# Altium schematic sheet Ref.03_DDR_Memory_2.SchDoc
size A2; SheetNumber: 11; SheetTotal: 11
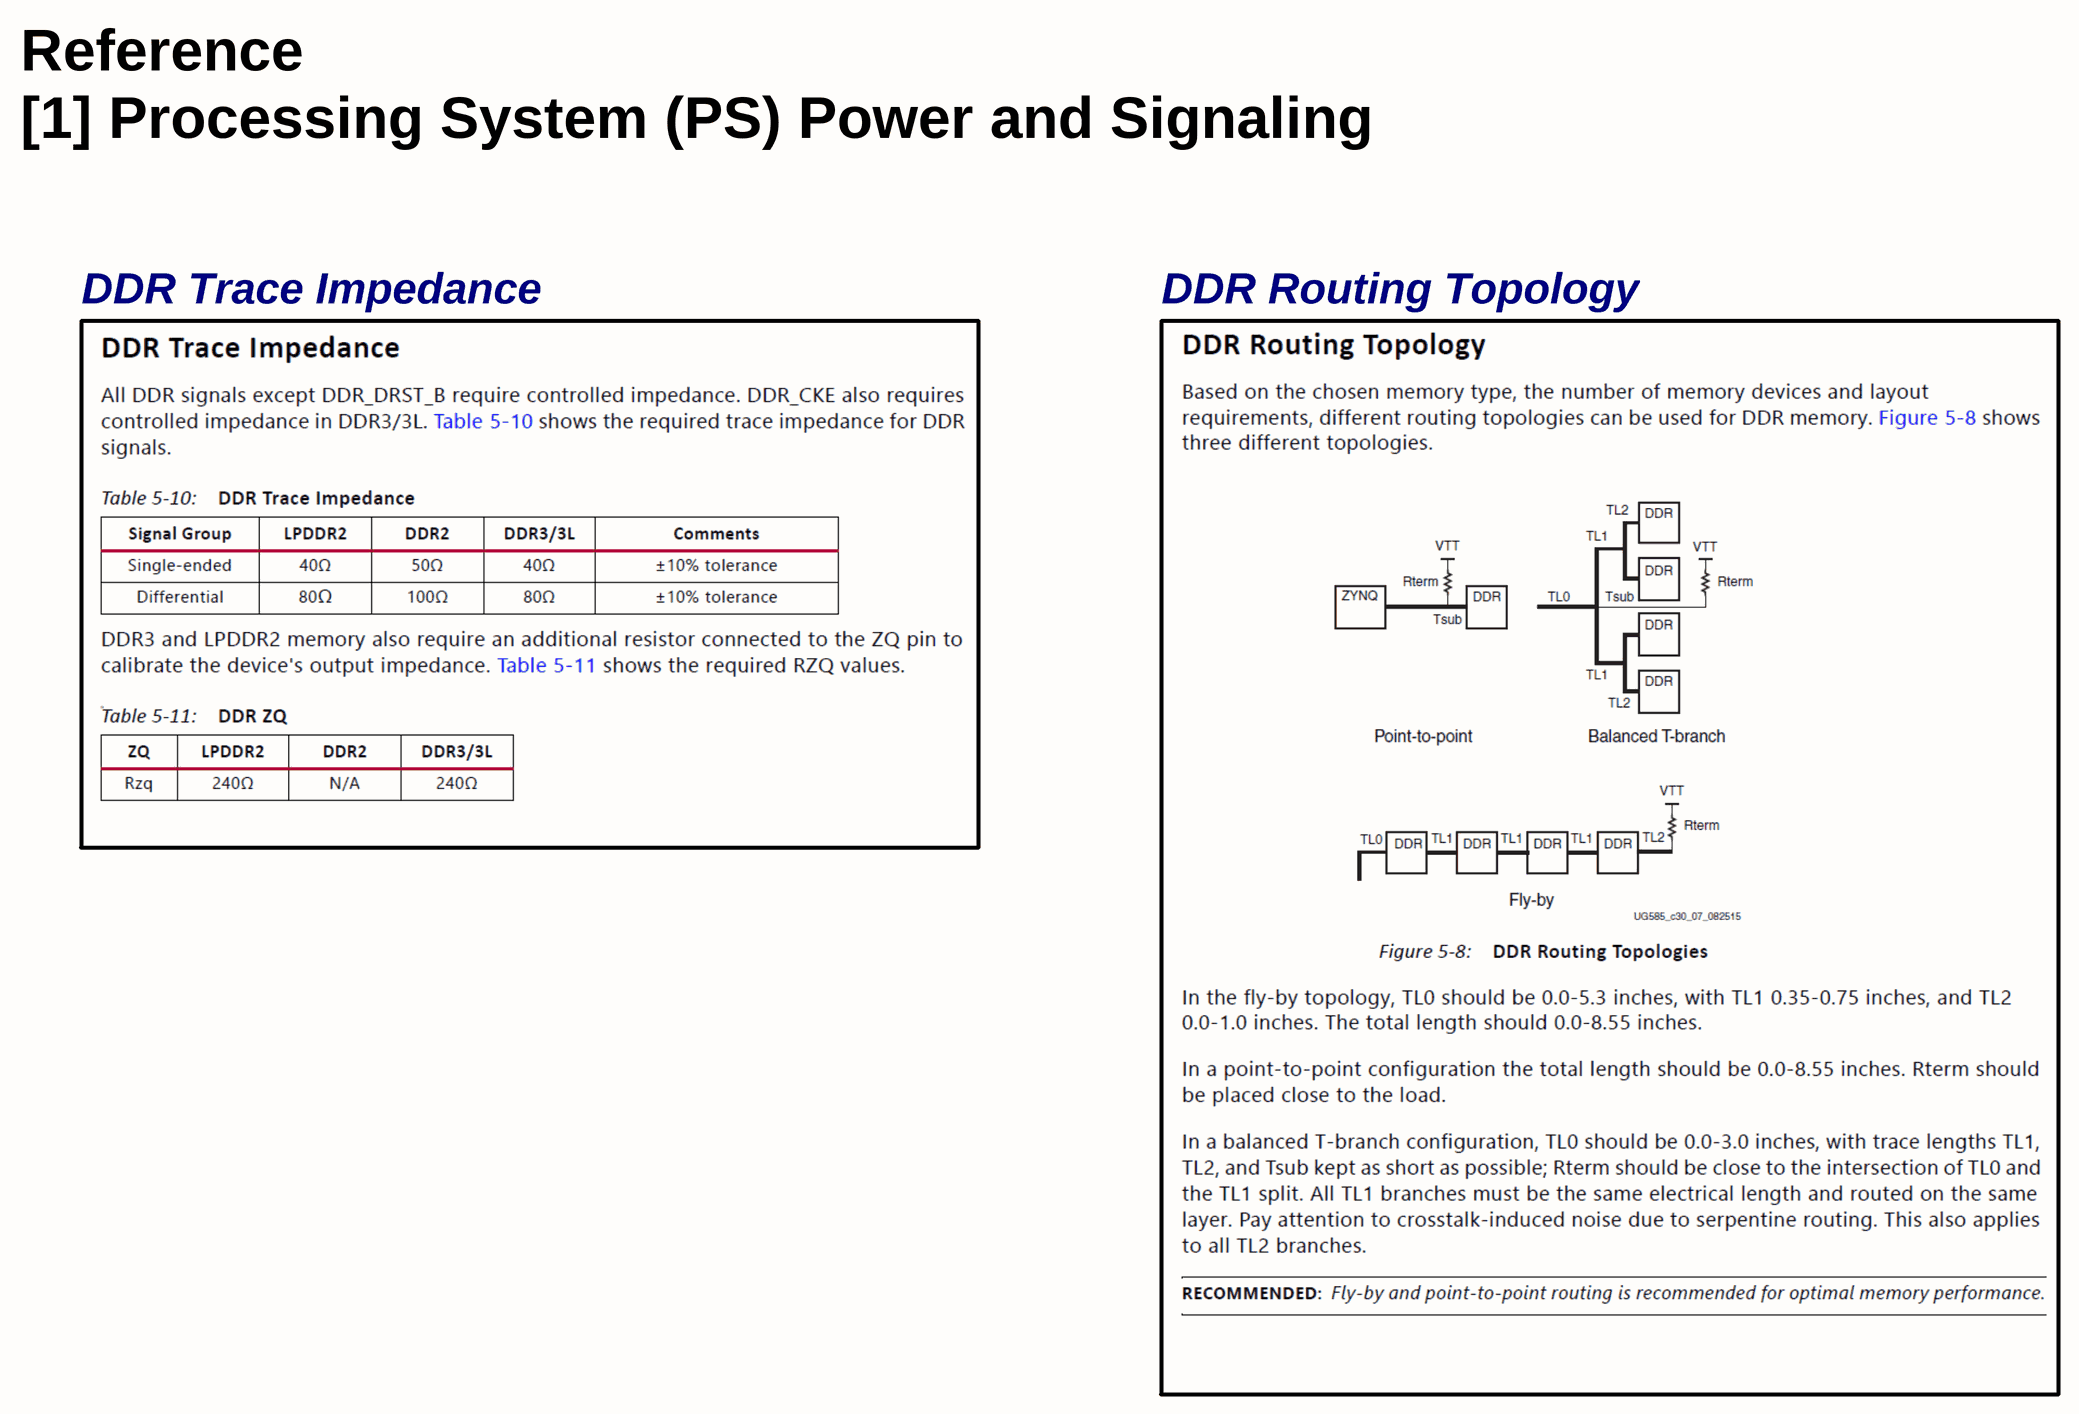
[diagram p0: Ref.03_DDR_Memory_2.SchDoc]

## Notes on the sheet
- Reference
- [1] Processing System (PS) Power and Signaling
- DDR Trace Impedance
- DDR Routing Topology
- Title
- Rev
- Doc
- Sheet #
- of
- Author
- This document is copyright of ArkX and shall not be revealed, produced, copied, in whole or in part,
- Date
- nor used for any purpose other than submitted.